# EAGLE schematic Power module (EAGLE 9.3.1)
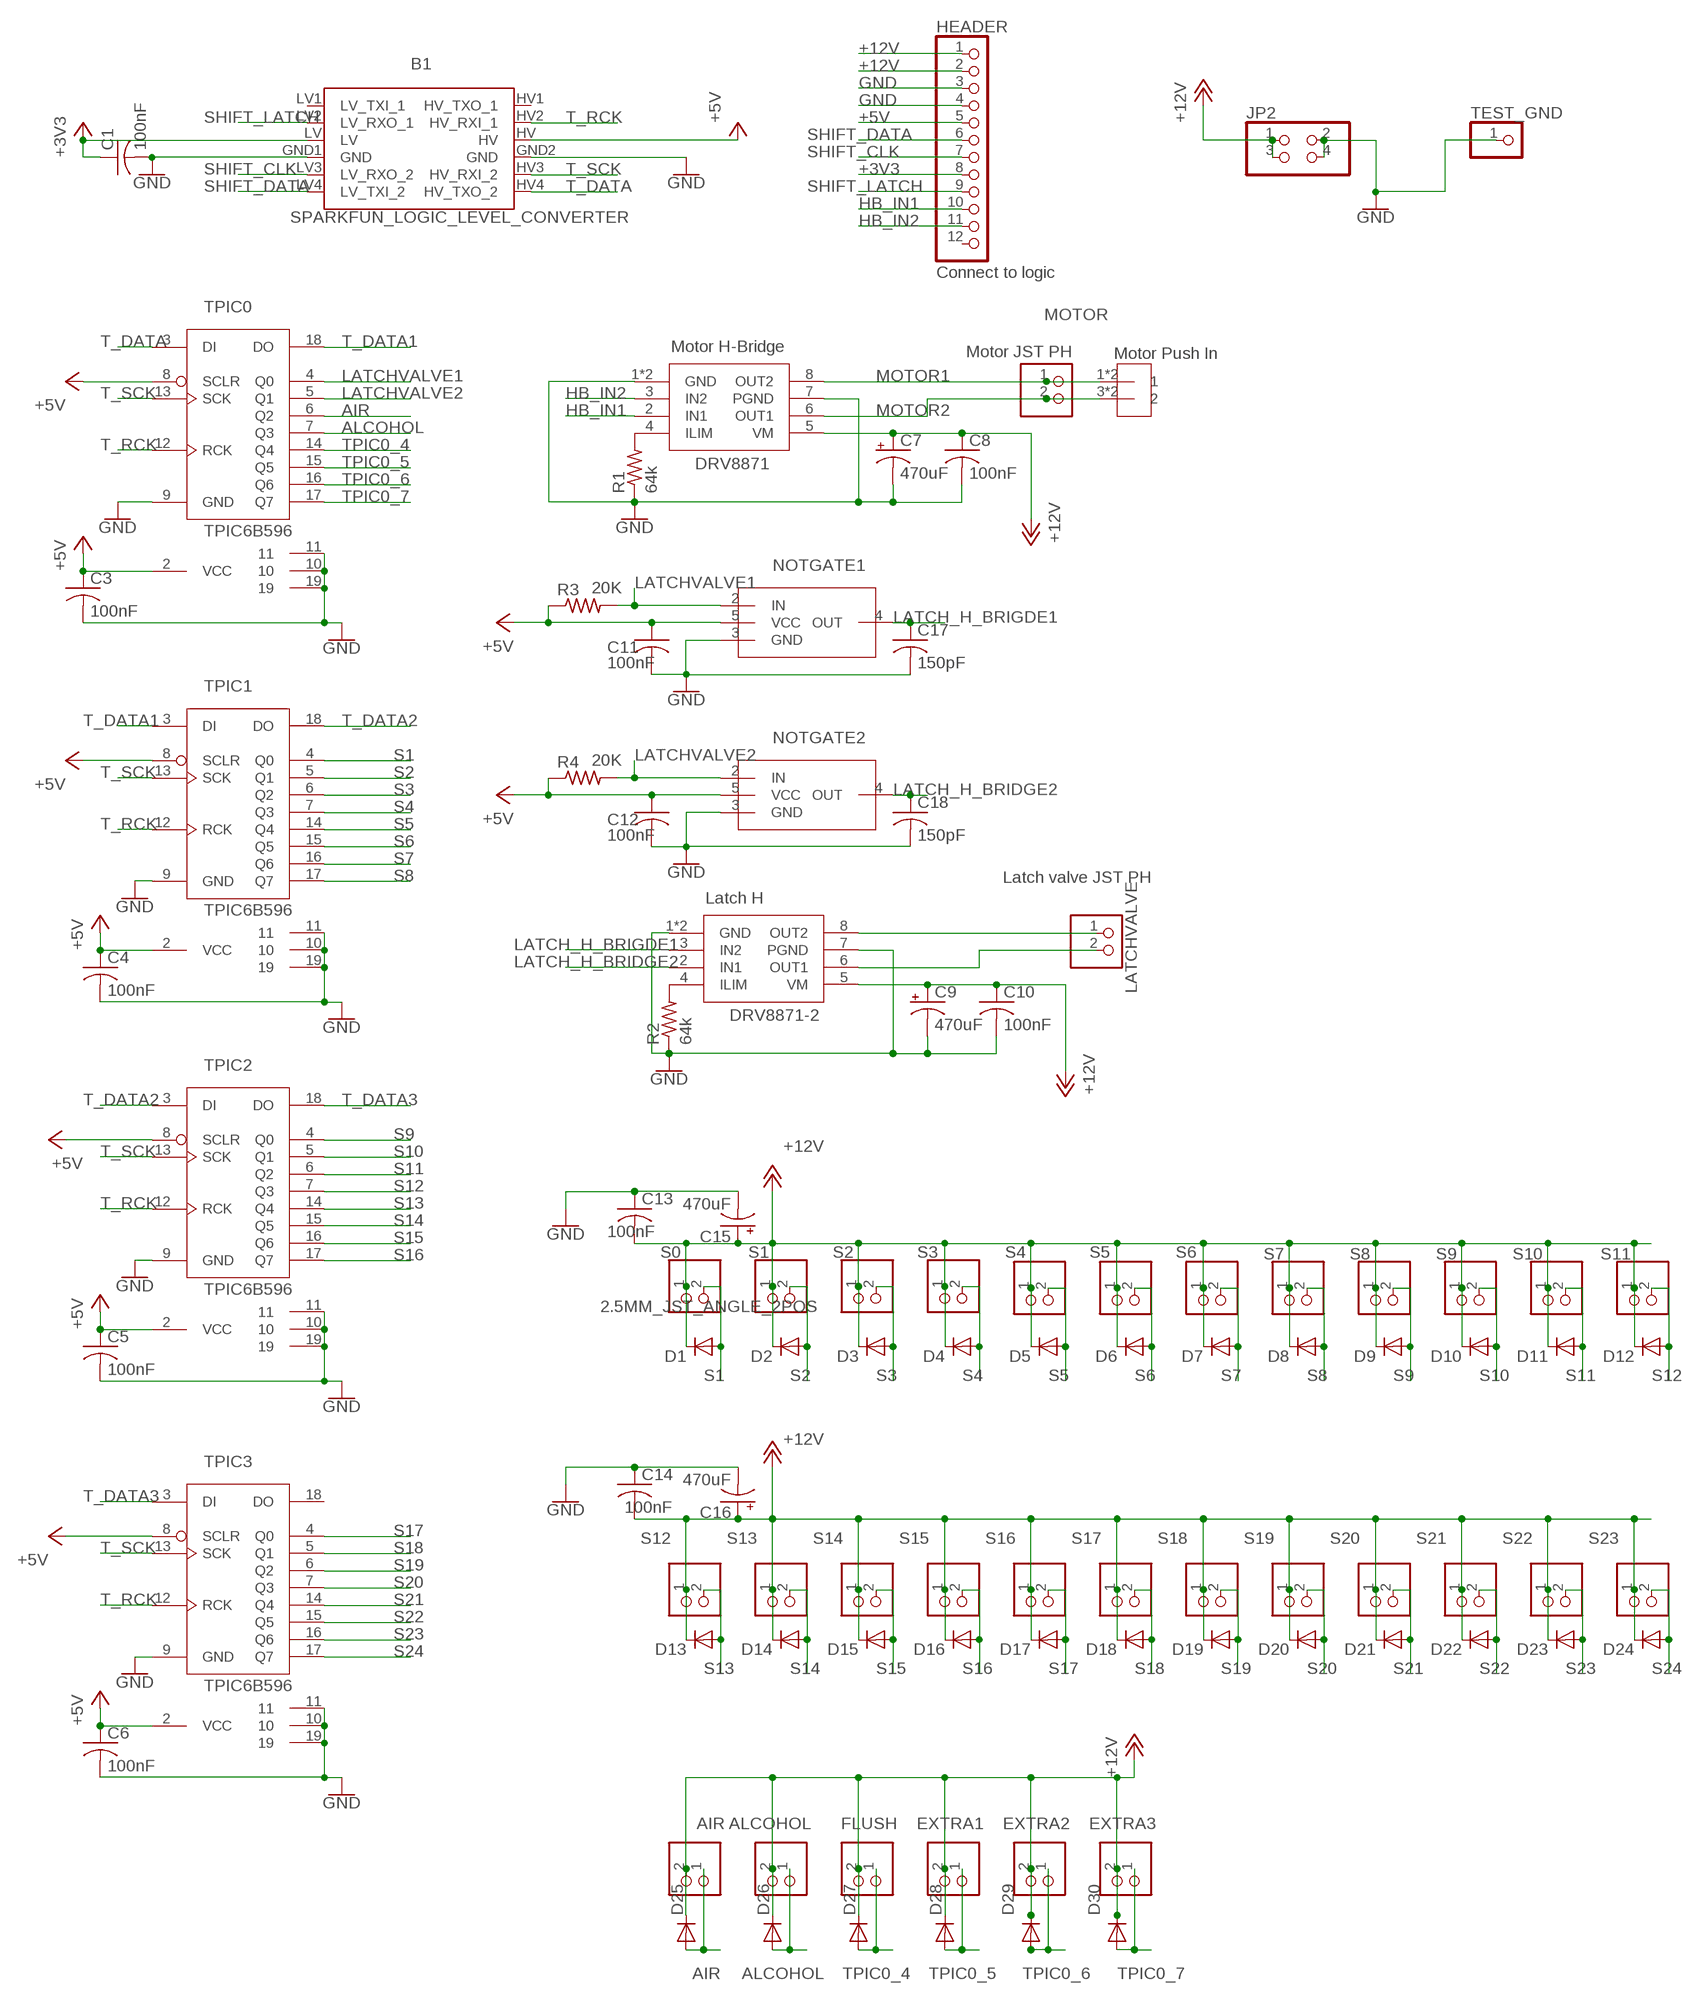
[diagram p0: schematic, sheet 1]

## Parts
AIR  2.5MM_JST_UP_2POS  [JST_2POS_2.5MM_UP]
ALCOHOL  2.5MM_JST_UP_2POS  [JST_2POS_2.5MM_UP]
B1  SPARKFUN_LOGIC_LEVEL_CONVERTER  [SPARKFUN_LOGIC_LEVEL_CONVERTER]
C1  100nF  C-US050-024X044  [C050-024X044]
C3  100nF  C-US050-024X044  [C050-024X044]
C4  100nF  C-US050-024X044  [C050-024X044]
C5  100nF  C-US050-024X044  [C050-024X044]
C6  100nF  C-US050-024X044  [C050-024X044]
C7  470uF  CPOL-US140CLH-0810  [140CLH-0810]
C8  100nF  C-US050-024X044  [C050-024X044]
C9  470uF  CPOL-US140CLH-0810  [140CLH-0810]
C10  100nF  C-US050-024X044  [C050-024X044]
C11  100nF  C-USC1206  [C1206]
C12  100nF  C-USC1206  [C1206]
C13  100nF  C-US050-024X044  [C050-024X044]
C14  100nF  C-US050-024X044  [C050-024X044]
C15  470uF  CPOL-US140CLH-0810  [140CLH-0810]
C16  470uF  CPOL-US140CLH-0810  [140CLH-0810]
C17  150pF  C-US050-024X044  [C050-024X044]
C18  150pF  C-US050-024X044  [C050-024X044]
D1  DIODESOD-123  [SOD-123]
D2  DIODESOD-123  [SOD-123]
D3  DIODESOD-123  [SOD-123]
D4  DIODESOD-123  [SOD-123]
D5  DIODESOD-123  [SOD-123]
D6  DIODESOD-123  [SOD-123]
D7  DIODESOD-123  [SOD-123]
D8  DIODESOD-123  [SOD-123]
D9  DIODESOD-123  [SOD-123]
D10  DIODESOD-123  [SOD-123]
D11  DIODESOD-123  [SOD-123]
D12  DIODESOD-123  [SOD-123]
D13  DIODESOD-123  [SOD-123]
D14  DIODESOD-123  [SOD-123]
D15  DIODESOD-123  [SOD-123]
D16  DIODESOD-123  [SOD-123]
D17  DIODESOD-123  [SOD-123]
D18  DIODESOD-123  [SOD-123]
D19  DIODESOD-123  [SOD-123]
D20  DIODESOD-123  [SOD-123]
D21  DIODESOD-123  [SOD-123]
D22  DIODESOD-123  [SOD-123]
D23  DIODESOD-123  [SOD-123]
D24  DIODESOD-123  [SOD-123]
D25  DIODESOD-123  [SOD-123]
D26  DIODESOD-123  [SOD-123]
D27  DIODESOD-123  [SOD-123]
D28  DIODESOD-123  [SOD-123]
D29  DIODESOD-123  [SOD-123]
D30  DIODESOD-123  [SOD-123]
DRV8871  Motor H-Bridge  DRV8871  [SOP8]
DRV8871-2  Latch H  DRV8871  [SOP8]
EXTRA1  2.5MM_JST_UP_2POS  [JST_2POS_2.5MM_UP]
EXTRA2  2.5MM_JST_UP_2POS  [JST_2POS_2.5MM_UP]
EXTRA3  2.5MM_JST_UP_2POS  [JST_2POS_2.5MM_UP]
FLUSH  2.5MM_JST_UP_2POS  [JST_2POS_2.5MM_UP]
HEADER  Connect to logic  PINHD-1X12  [1X12]
JP2  PINHD-2X2  [2X02]
LATCHVALVE  Latch valve JST PH  2.5MM_JST_UP_2POS  [JST_2POS_2.5MM_UP]
MOTOR  Motor JST PH  2.5MM_JST_UP_2POS  [JST_2POS_2.5MM_UP]
NOTGATE1  NOT_GATE  [SOT753]
NOTGATE2  NOT_GATE  [SOT753]
R1  64k  R-US_0204/5  [0204/5]
R2  64k  R-US_0204/5  [0204/5]
R3  20K  R-US_R1206  [R1206]
R4  20K  R-US_R1206  [R1206]
S0  2.5MM_JST_ANGLE_2POS  [JST_2POS_2.5MM_ANGLE]
S1  2.5MM_JST_ANGLE_2POS  [JST_2POS_2.5MM_ANGLE]
S2  2.5MM_JST_ANGLE_2POS  [JST_2POS_2.5MM_ANGLE]
S3  2.5MM_JST_ANGLE_2POS  [JST_2POS_2.5MM_ANGLE]
S4  2.5MM_JST_ANGLE_2POS  [JST_2POS_2.5MM_ANGLE]
S5  2.5MM_JST_ANGLE_2POS  [JST_2POS_2.5MM_ANGLE]
S6  2.5MM_JST_ANGLE_2POS  [JST_2POS_2.5MM_ANGLE]
S7  2.5MM_JST_ANGLE_2POS  [JST_2POS_2.5MM_ANGLE]
S8  2.5MM_JST_ANGLE_2POS  [JST_2POS_2.5MM_ANGLE]
S9  2.5MM_JST_ANGLE_2POS  [JST_2POS_2.5MM_ANGLE]
S10  2.5MM_JST_ANGLE_2POS  [JST_2POS_2.5MM_ANGLE]
S11  2.5MM_JST_ANGLE_2POS  [JST_2POS_2.5MM_ANGLE]
S12  2.5MM_JST_ANGLE_2POS  [JST_2POS_2.5MM_ANGLE]
S13  2.5MM_JST_ANGLE_2POS  [JST_2POS_2.5MM_ANGLE]
S14  2.5MM_JST_ANGLE_2POS  [JST_2POS_2.5MM_ANGLE]
S15  2.5MM_JST_ANGLE_2POS  [JST_2POS_2.5MM_ANGLE]
S16  2.5MM_JST_ANGLE_2POS  [JST_2POS_2.5MM_ANGLE]
S17  2.5MM_JST_ANGLE_2POS  [JST_2POS_2.5MM_ANGLE]
S18  2.5MM_JST_ANGLE_2POS  [JST_2POS_2.5MM_ANGLE]
S19  2.5MM_JST_ANGLE_2POS  [JST_2POS_2.5MM_ANGLE]
S20  2.5MM_JST_ANGLE_2POS  [JST_2POS_2.5MM_ANGLE]
S21  2.5MM_JST_ANGLE_2POS  [JST_2POS_2.5MM_ANGLE]
S22  2.5MM_JST_ANGLE_2POS  [JST_2POS_2.5MM_ANGLE]
S23  2.5MM_JST_ANGLE_2POS  [JST_2POS_2.5MM_ANGLE]
TEST_GND  PINHD-1X1  [1X01]
TPIC0  TPIC6B596  [DIP20]
TPIC1  TPIC6B596  [DIP20]
TPIC2  TPIC6B596  [DIP20]
TPIC3  TPIC6B596  [DIP20]
U$1  Motor Push In  PUSH_IN_2  [3.5MM_DIP2]

## Nets
+3V3: B1.LV C1.1 HEADER.8
+5V: B1.HV C3.1 C4.1 C5.1 C6.1 C11.1 C12.1 HEADER.5 NOTGATE1.5(VCC) NOTGATE2.5(VCC) R3.1 R4.1 TPIC0.2(VCC) TPIC0.8(SCLR) TPIC1.2(VCC) TPIC1.8(SCLR) TPIC2.2(VCC) TPIC2.8(SCLR) TPIC3.2(VCC) TPIC3.8(SCLR)
+12V: AIR.2 ALCOHOL.2 C7.+ C8.1 C9.+ C10.1 C13.2 C14.2 C15.+ C16.+ D1.C D2.C D3.C D4.C D5.C D6.C D7.C D8.C D9.C D10.C D11.C D12.C D13.C D14.C D15.C D16.C D17.C D18.C D19.C D20.C D21.C D22.C D23.C D24.C D25.C D26.C D27.C D28.C D29.C D30.C DRV8871-2.5(VM) DRV8871.5(VM) EXTRA1.2 EXTRA2.2 EXTRA3.2 FLUSH.2 HEADER.1 HEADER.2 JP2.1 JP2.3 S0.1 S1.1 S2.1 S3.1 S4.1 S5.1 S6.1 S7.1 S8.1 S9.1 S10.1 S11.1 S12.1 S13.1 S14.1 S15.1 S16.1 S17.1 S18.1 S19.1 S20.1 S21.1 S22.1 S23.1
AIR: AIR.1 D25.A TPIC0.6(Q2)
ALCOHOL: ALCOHOL.1 D26.A TPIC0.7(Q3)
GND: B1.GND1(GND) B1.GND2(GND) C1.2 C3.2 C4.2 C5.2 C6.2 C7.- C8.2 C9.- C10.2 C11.2 C12.2 C13.1 C14.1 C15.- C16.- C17.2 C18.2 DRV8871-2.1(GND) DRV8871-2.7(PGND) DRV8871-2.GND DRV8871.1(GND) DRV8871.7(PGND) DRV8871.GND HEADER.3 HEADER.4 JP2.2 JP2.4 NOTGATE1.3(GND) NOTGATE2.3(GND) R1.1 R2.1 TEST_GND.1 TPIC0.9(GND) TPIC0.10 TPIC0.11 TPIC0.19 TPIC1.9(GND) TPIC1.10 TPIC1.11 TPIC1.19 TPIC2.9(GND) TPIC2.10 TPIC2.11 TPIC2.19 TPIC3.9(GND) TPIC3.10 TPIC3.11 TPIC3.19
HB_IN1: DRV8871.2(IN1) HEADER.10
HB_IN2: DRV8871.3(IN2) HEADER.11
LATCH_H_BRIDGE2: C18.1 DRV8871-2.2(IN1) NOTGATE2.4(OUT)
LATCH_H_BRIGDE1: C17.1 DRV8871-2.3(IN2) NOTGATE1.4(OUT)
LATCHVALVE1: NOTGATE1.2(IN) R3.2 TPIC0.4(Q0)
LATCHVALVE2: NOTGATE2.2(IN) R4.2 TPIC0.5(Q1)
MOTOR1: DRV8871.8(OUT2) MOTOR.1 U$1.1 U$1.2
MOTOR2: DRV8871.6(OUT1) MOTOR.2 U$1.3 U$1.4
N$1: DRV8871-2.4(ILIM) R2.2
N$2: DRV8871.4(ILIM) R1.2
N$3: DRV8871-2.8(OUT2) LATCHVALVE.1
N$4: DRV8871-2.6(OUT1) LATCHVALVE.2
S1: D1.A S0.2 TPIC1.4(Q0)
S2: D2.A S1.2 TPIC1.5(Q1)
S3: D3.A S2.2 TPIC1.6(Q2)
S4: D4.A S3.2 TPIC1.7(Q3)
S5: D5.A S4.2 TPIC1.14(Q4)
S6: D6.A S5.2 TPIC1.15(Q5)
S7: D7.A S6.2 TPIC1.16(Q6)
S8: D8.A S7.2 TPIC1.17(Q7)
S9: D9.A S8.2 TPIC2.4(Q0)
S10: D10.A S9.2 TPIC2.5(Q1)
S11: D11.A S10.2 TPIC2.6(Q2)
S12: D12.A S11.2 TPIC2.7(Q3)
S13: D13.A S12.2 TPIC2.14(Q4)
S14: D14.A S13.2 TPIC2.15(Q5)
S15: D15.A S14.2 TPIC2.16(Q6)
S16: D16.A S15.2 TPIC2.17(Q7)
S17: D17.A S16.2 TPIC3.4(Q0)
S18: D18.A S17.2 TPIC3.5(Q1)
S19: D19.A S18.2 TPIC3.6(Q2)
S20: D20.A S19.2 TPIC3.7(Q3)
S21: D21.A S20.2 TPIC3.14(Q4)
S22: D22.A S21.2 TPIC3.15(Q5)
S23: D23.A S22.2 TPIC3.16(Q6)
S24: D24.A S23.2 TPIC3.17(Q7)
SHIFT_CLK: B1.LV3(LV_RXO_2) HEADER.7
SHIFT_DATA: B1.LV4(LV_TXI_2) HEADER.6
SHIFT_LATCH: B1.LV2(LV_RXO_1) HEADER.9
T_DATA: B1.HV4(HV_TXO_2) TPIC0.3(DI)
T_DATA1: TPIC0.18(DO) TPIC1.3(DI)
T_DATA2: TPIC1.18(DO) TPIC2.3(DI)
T_DATA3: TPIC2.18(DO) TPIC3.3(DI)
T_RCK: B1.HV2(HV_RXI_1) TPIC0.12(RCK) TPIC1.12(RCK) TPIC2.12(RCK) TPIC3.12(RCK)
T_SCK: B1.HV3(HV_RXI_2) TPIC0.13(SCK) TPIC1.13(SCK) TPIC2.13(SCK) TPIC3.13(SCK)
TPIC0_4: D27.A FLUSH.1 TPIC0.14(Q4)
TPIC0_5: D28.A EXTRA1.1 TPIC0.15(Q5)
TPIC0_6: D29.A EXTRA2.1 TPIC0.16(Q6)
TPIC0_7: D30.A EXTRA3.1 TPIC0.17(Q7)
Unconnected: B1.HV1(HV_TXO_1) B1.LV1(LV_TXI_1) HEADER.12 TPIC3.18(DO)

## Library data of the parts
AIR ALCOHOL EXTRA1-EXTRA3 FLUSH LATCHVALVE MOTOR = eDNA:2.5MM_JST_UP_2POS
B1 = SparkFun-Boards:SPARKFUN_LOGIC_LEVEL_CONVERTER: SparkFun Logic Level Converter -Bi-Directional This is the mechnical outline for the 3.3V - 5V bi directional logic level converter. *Note, the "LOCK" Package has the header pins staggered by an offset of 5 mils (off center line), so that when you slide a row of standard 0.1" headers into the PTH pads, it will hold position vertically. See the follwing turorial for more information on this type of special footprints: Sneaky Footprints <https://www.sparkfun.com/tutorials/114> SparkFun Products: SparkFun Logic Level Converter - Bi-Directional <https://www.sparkfun.com/products/12009>
C1 C3-C6 C8 C10-C14 C17 C18 = adafruit:C-US: CAPACITOR, American symbol
C7 C9 C15 C16 = adafruit:CPOL-US: POLARIZED CAPACITOR, American symbol
D1-D30 = adafruit:DIODE: Diode SMADIODE - SMA Surface Mount Package 20V 1A Schottky Diode Digikey: 641-1014-6-ND DO-1N4148 - Through Hole Small Current Diode SOD-123 20V 1 A (.5mV Vf) Schottky Diode - Digikey: MBRX120TPMSCT-ND SOD-323 10V 570mA (.38mV Vf, 3ns) Schottky Diode - Digikey: ZLLS410CT-ND SOD-523 30V 30mA Schottky Diode (RB751S-40TE61) - Digikey: RB751S-40TE61CT-ND SOT23-R/W - SOT23 Package (R = Solder Paste/Reflow Ovens, W = Hand-Soldering) BAT54Film 40V 300mA - Digikey: 497-7162-1-ND
DRV8871 DRV8871-2 = eDNA:DRV8871
HEADER = adafruit:PINHD-1X12: PIN HEADER
JP2 = pinhead:PINHD-2X2: PIN HEADER
NOTGATE1 NOTGATE2 = eDNA:NOT_GATE
R1-R4 = adafruit:R-US_: RESISTOR, American symbol
S0 S1-S23 = eDNA:2.5MM_JST_ANGLE_2POS
TEST_GND = pinhead:PINHD-1X1: PIN HEADER
TPIC0 TPIC1-TPIC3 = eDNA:TPIC6B596
U$1 = eDNA:PUSH_IN_2: Push in to connect Phoenix Contact - 3.5 mm through hole Can be ordered from : https://www.digikey.com/product-detail/en/phoenix-contact/1864286/277-12184-ND/6605434 OpenSensingLab OSU